# Altium schematic sheet flyback.SchDoc
size Legal; SheetNumber: 4
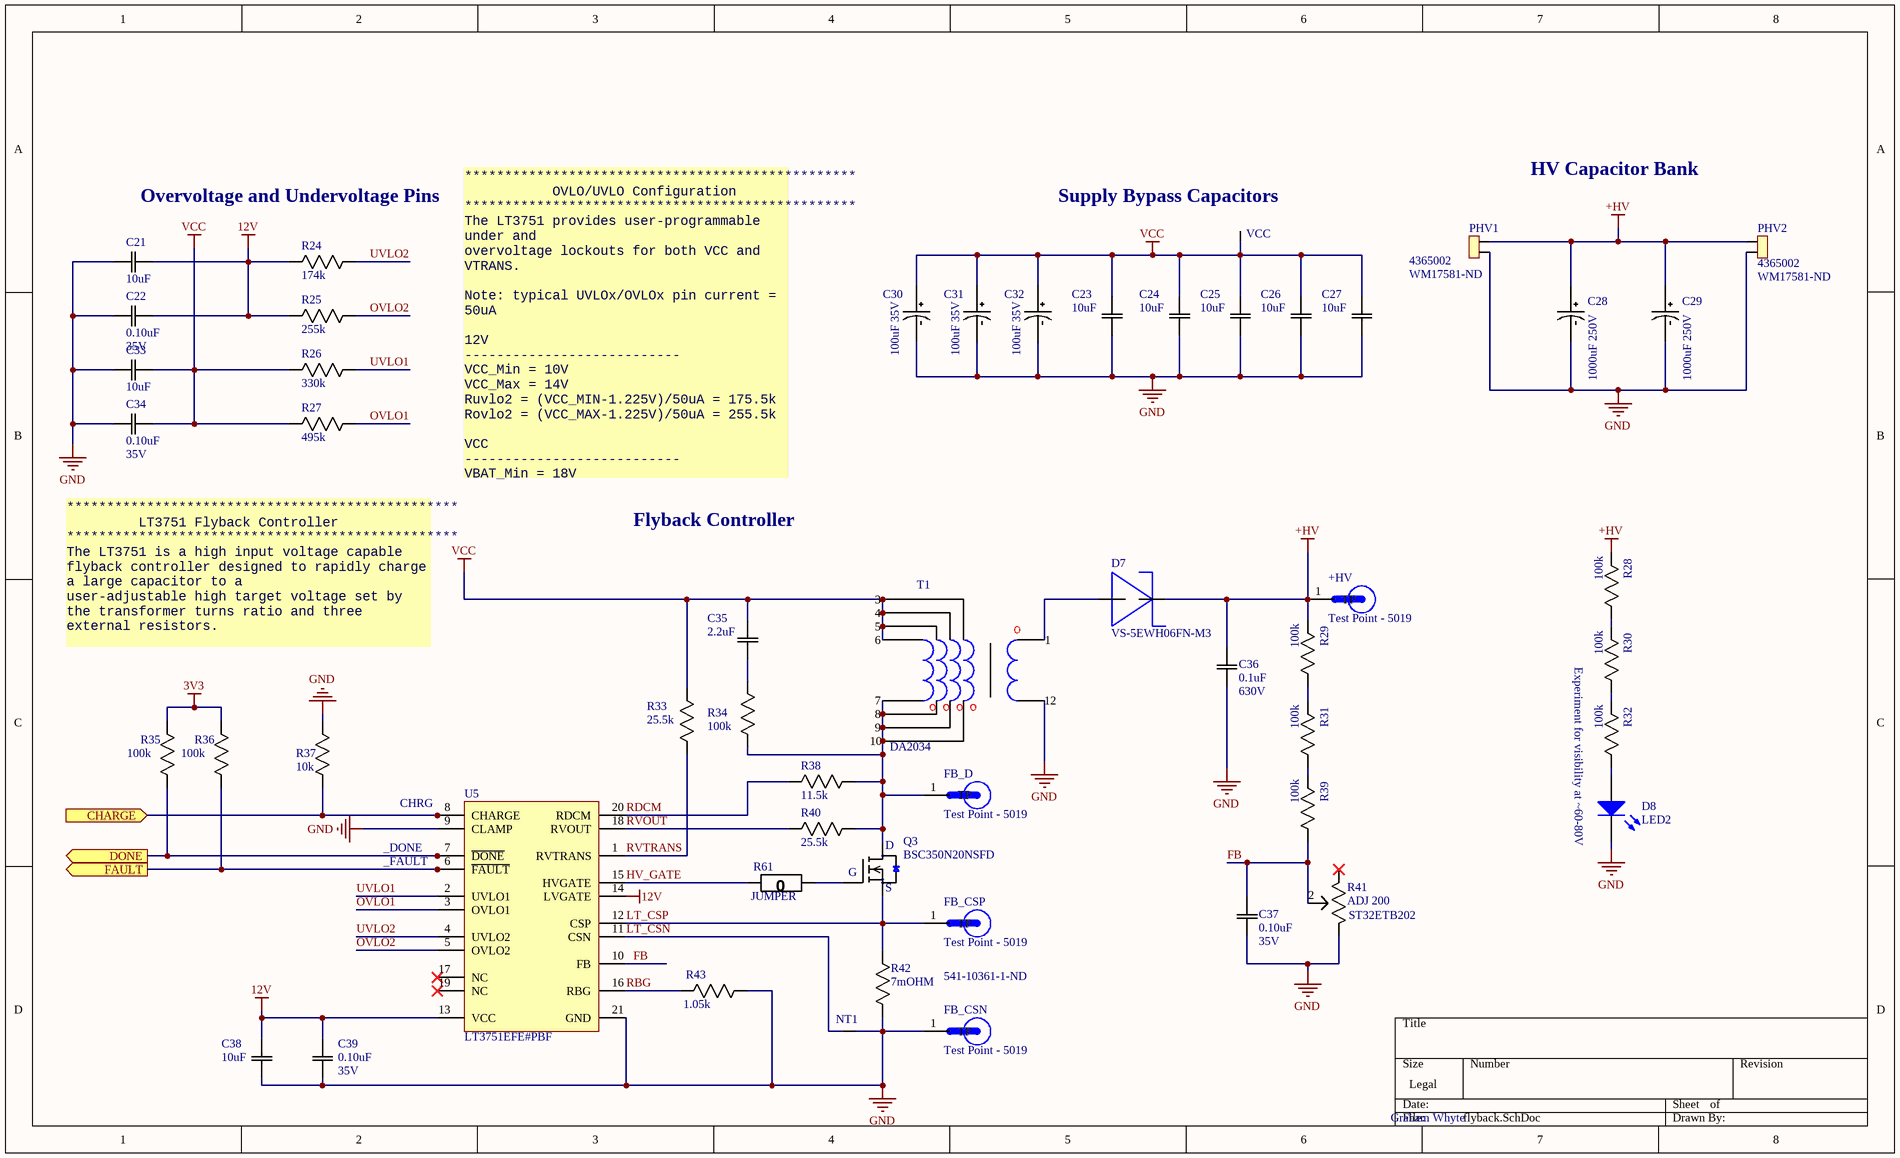
[diagram p0: flyback.SchDoc]

## Parts
+HV  Test Point - 5019  [TP380X203]
_DONE  Test Point (Via)  [TP]  (value not drawn)
_FAULT  Test Point (Via)  [TP]  (value not drawn)
C21  10uF  [0805]
C22  Rating: 35V  [0805]  (hidden comment: 0.10uF)
C23  10uF  [0805]
C24  10uF  [0805]
C25  10uF  [0805]
C26  10uF  [0805]
C27  10uF  [0805]
C28  1000uF 250V  [RADIAL, CAN - THRU 25.4mm]
C29  1000uF 250V  [RADIAL, CAN - THRU 25.4mm]
C30  100uF 35V  [CAP POL ALU 6.3x5.8]
C31  100uF 35V  [CAP POL ALU 6.3x5.8]
C32  100uF 35V  [CAP POL ALU 6.3x5.8]
C33  10uF  [0805]
C34  Rating: 35V  [0805]  (hidden comment: 0.10uF)
C35  2.2uF  [0805]
C36  Rating: 630V  [1210]  (hidden comment: 0.1uF)
C37  Rating: 35V  [0805]  (hidden comment: 0.10uF)
C38  10uF  [0805]
C39  Rating: 35V  [0805]  (hidden comment: 0.10uF)
CHRG  Test Point (Via)  [TP]  (value not drawn)
D7  VS-5EWH06FN-M3  [DPAK (TO-252)]
D8  LED2  [3.2X1.6X1.1]
FB_CSN  Test Point - 5019  [TP380X203]
FB_CSP  Test Point - 5019  [TP380X203]
FB_D  Test Point - 5019  [TP380X203]
NT1  8mil Nettie  [NT_8mil]  (value not drawn)
PHV1  4365002  Supplier Part Number 2: WM17581-ND  [43650-02]
PHV2  4365002  Supplier Part Number 2: WM17581-ND  [43650-02]
Q3  BSC350N20NSFD  [8-PowerSMD]
R24  174k  [0805]
R25  255k  [0805]
R26  330k  [0805]
R27  495k  [0805]
R28  100k  [0805]
R29  100k  [0805]
R30  100k  [0805]
R31  100k  [0805]
R32  100k  [0805]
R33  25.5k  [0805]
R34  100k  [0805]
R35  100k  [0805]
R36  100k  [0805]
R37  10k  [0805]
R38  11.5k  [0805]
R39  100k  [0805]
R40  25.5k  [0805]
R41  ADJ 200  [POT SMD]
R42  7mOHM  Supplier Part Number 1: 541-10361-1-ND  [2512]
R43  1.05k  [0805]
R61  JUMPER  [0805]
T1  DA2034  [DA2034]
U5  LT3751EFE#PBF  [LT-FE-20-EPV-CB_L]
VCC  Test Point (Via)  [TP]  (value not drawn)

## Ports
CHARGE (in), DONE (out), FAULT (out)

## Nets
3V3: R35.2(R2) R36.2(R2)
12V: C21.2(C2) C22.2(C2) C38.1(C1) C39.1(C1) R24.2(R2) R25.2(R2) U5.13(VCC) U5.14(LVGATE)
+HV: +HV.1(TP) C28.POS C29.POS C36.1(C1) D7.OUT PHV1.2 PHV2.2 R28.2(R2) R29.2(R2)
GND: C21.1(C1) C22.1(C1) C23.1(C1) C24.1(C1) C25.1(C1) C26.1(C1) C27.1(C1) C28.NEG C29.NEG C30.NEG C31.NEG C32.NEG C33.1(C1) C34.1(C1) C36.2(C2) C37.2(C2) C38.2(C2) C39.2(C2) D8.2(K) FB_CSN.1(TP) NT1.2 PHV1.1 PHV2.1 R37.1(R1) R41.3 R42.1(R1) R43.1(R1) T1.12 U5.9(CLAMP) U5.21(GND)
VCC: C23.2(C2) C24.2(C2) C25.2(C2) C26.2(C2) C27.2(C2) C30.POS C31.POS C32.POS C33.2(C2) C34.2(C2) C35.2(C2) R26.2(R2) R27.2(R2) R33.1(R1) T1.3 T1.4 T1.5 T1.6 VCC.1
CHARGE: CHRG.1 R37.2(R2) U5.8(CHARGE) ; port CHARGE
DONE: _DONE.1 R35.1(R1) U5.7(~{DONE}) ; port DONE
FAULT: _FAULT.1 R36.1(R1) U5.6(~{FAULT}) ; port FAULT
FB: C37.1(C1) R39.1(R1) R41.2 U5.10(FB)
HV_GATE: R61.2(R2) U5.15(HVGATE)
LT_CSN: NT1.1 U5.11(CSN)
LT_CSP: FB_CSP.1(TP) Q3.S R42.2(R2) U5.12(CSP)
OVLO1: R27.1(R1) U5.3(OVLO1)
OVLO2: R25.1(R1) U5.5(OVLO2)
RBG: R43.2(R2) U5.16(RBG)
RDCM: R38.2(R2) U5.20(RDCM)
RVOUT: R40.2(R2) U5.18(RVOUT)
RVTRANS: R33.2(R2) U5.1(RVTRANS)
UVLO1: R26.1(R1) U5.2(UVLO1)
UVLO2: R24.1(R1) U5.4(UVLO2)
NetC35_1: C35.1(C1) R34.1(R1)
NetD7_IN: D7.IN T1.1
NetD8_1: D8.1(A) R32.1(R1)
NetFB_D_1: FB_D.1(TP) Q3.D R34.2(R2) R38.1(R1) R40.1(R1) T1.7 T1.8 T1.9 T1.10
NetQ3_G: Q3.G R61.1(R1)
NetR28_1: R28.1(R1) R30.2(R2)
NetR29_1: R29.1(R1) R31.2(R2)
NetR30_1: R30.1(R1) R32.2(R2)
NetR31_1: R31.1(R1) R39.2(R2)

Not connected (* = marked no-connect by the designer): R41 1*; U5 17(NC)* 19(NC)*

## Notes on the sheet
- Overvoltage and Undervoltage Pins
- (near VCC) Supply Bypass Capacitors
- HV Capacitor Bank
- *************************************************
  OVLO/UVLO Configuration
  *************************************************
  The LT3751 provides user-programmable under and
  overvoltage lockouts for both VCC and VTRANS.
  Note: typical UVLOx/OVLOx pin current = 50uA
  12V
  ---------------------------
  VCC_Min = 10V
  VCC_Max = 14V
  Ruvlo2 = (VCC_MIN-1.225V)/50uA = 175.5k
  Rovlo2 = (VCC_MAX-1.225V)/50uA = 255.5k
  VCC
  ---------------------------
  VBAT_Min = 18V
  VBAT_Max = 26V
  Ruvlo1 = (VBAT_MIN-1.225V)/50uA = 335.5k
  Rovlo1 = (VBAT_MAX-1.225V)/50uA = 495.5k
- Flyback Controller
- *************************************************
  LT3751 Flyback Controller
  *************************************************
  The LT3751 is a high input voltage capable flyback controller designed to rapidly charge a large capacitor to a
  user-adjustable high target voltage set by the transformer turns ratio and three external resistors.
- Experiment for visibility at ~60-80V
- (near R41) ST32ETB202
- Graham Whyte

## Library data of the parts
+HV FB_CSN FB_CSP FB_D = Test Point - 5019: PC Test Point, Miniature Phosphor Bronze, Silver Plating Surface Mount Mounting Type; MP: 5019; MF: Keystone Electronics; Value: *; Package: 2010 Keystone; Digi-Key_Part_Number: 36-5019CT-ND; Digi-Key_Purchase_URL: https://www.digikey.com/product-detail/en/keystone-electronics/5019/36-5019CT-ND/3907344?utm_source=snapeda&utm_medium=aggregator&utm_campaign=symbol
C21 C23-C27 C33 C38 = CAP 10uF 35V: CAP CER 10UF 35V X7R 0805; Tolerance: 10%; Package: 0805; Value: 10uF; Rating: 35V; Temperature Coefficient: X7R; Operating Temperature: -55°C ~ 125°C
C22 C34 C37 C39 = CAP 0.10uF 35V: CAP CER 0.10UF 35V X7R 0603/0805; Tolerance: 10%; Package: 0603/0805; Temperature Coefficient: X7R; Operating Temperature: -55°C ~ 125°C; Value: 0.10uF
C28 C29 = CAP POL 1000uF: United Chemi-Con / ESMQ251VSN102MQ45S; Dielectric Material: Aluminium; Life (Hours): 2000Hour; Capacitance: 1mF; Tolerance: 20%; Ripple Current: 960mA; Lead Diameter: 2mm; Supplier 1: Digi-Key; Manufacturer: United Chemi-Con; Manufacturer Part Number: ESMQ251VSN102MQ45S; RoHS: Yes; Mount: Through Hole,PCB; Case/Package: Radial; Number of Pins: 2; Min Operating Temperature: -40°C; Max Operating Temperature: 85°C; Termination: Radial; Voltage: 250V; Diameter: 25.4mm; Height - Seated (Max): 45mm; Lead Pitch: 10mm; REACH SVHC: No SVHC; Lead Free: Lead Free; Supplier Part Number 1: 565-2754-ND
C30-C32 = CAP POL 100uF SMD: CAP ALUM 100UF 35V SMD; Value: 10uF; Tolerance: 20%; Rating: 50V; Temperature Coefficient: Unspecified; ComponentLink1Description: Digikey Link; ComponentLink1URL: https://www.digikey.ca/product-detail/en/panasonic-electronic-components/ECA-1HM100I/P10425CT-ND/8603345; Package: RADIAL; Operating Temperature: -40°C ~ 85°C; Dimensions: 0.197" Dia (5.00mm)
C35 = CAP 2.2uF 16V: CAP CER 2.2UF 16V X5R 0603/0805; Tolerance: 10%; Package: 0603/0805; Value: 2.2uF; Rating: 16V; Temperature Coefficient: X5R; Operating Temperature: -55°C ~ 85°C
C36 = CAP 0.1uF 630V: CAP CER 0.1uF 630V X7R 1210; Tolerance: 10%; Package: 1210; Temperature Coefficient: X7R; Operating Temperature: -55°C ~ 125°C; Value: 0.1uF
D7 = VS-5EWH06FN-M3: Diode Switching 600V 5A DPAK; pin to pad: IN>3 OUT>2; MF: Vishay Diodes; MF PN: VS-5EWH06FN-M3; Digikey: VS-5EWH06FN-M3-ND; Digikey Link: https://www.digikey.ca/en/products/detail/vishay-semiconductor-diodes-division/VS-5EWH06FN-M3/4934509
D8 = LED GREEN SMD: Typical RED, GREEN, YELLOW, AMBER GaAs LED; Voltage - Forward (Vf) (Typ): 2V; Lens Transparency: Clear; Current - Test: 20mA; Package: 1206; Color: Green
NT1 = NT_8: 8mil wide nettie
PHV1 PHV2 = CN MOLEX 4365002XX: MOLEX MICROFIT 2CKT RIGHT THRU; MF: MOLEX; MP: 4365002XX; Digikey: WM17581-ND; Digikey Link: https://www.digikey.com/en/products/detail/molex/0436500205/3310532?s=N4IgTCBcDaICwGYBsBWADGsaUgLoF8g; Package: Microfit; Price: 1.44 CAD; Value: N/A; Supplier 1: Digi-Key
Q3 = MOSFET BSC320N20NS3: MOSFET N-CH 36A 200V; MF: Infineon; Package: 8-PowerTDFN; Digikey: BSC320N20NS3GATMA1CT-ND; Digikey Link: https://www.digikey.ca/en/products/detail/infineon-technologies/BSC320N20NS3GATMA1/2337851; Supplier 1: Digi-Key; Supplier Part Number 1: BSC320N20NS3GATMA1CT-ND
R24 = RES 174k 1/8W: RES SMD 174K OHM 1% 1/8W 0805; Manufacturer: Yageo; Manufacturer Part Number: RC0805FR-07174KL; Max Power Dissipation: 125mW; Resistance: 174kR; Temperature Coefficient: 100ppm/°C; Voltage Rating: 150V; Supplier 1: Digi-Key; RoHS: Yes; Category: Chip SMD Resistors; Stock 1: 27863; Pricing 1: 1=0.10000, 10=0.04000, 100=0.01630, 1000=0.00731, 2500=0.00635 (USD); Case/Package: 0805; Case Code (Metric): 2012; Case Code (Imperial): 0805; Contact Plating: Tin,Matte; Min Operating Temperature: -55°C; Max Operating Temperature: 155°C; Package Quantity: 1; Power Rating: 125mW; Tolerance: 1%; Packaging: Tape and Reel; Features: Moisture Resistant; Composition: Thick Film; Number of Terminations: 2; Termination: SMD/SMT; Military Standard: Not; Voltage Rating (DC): 150V; Length: 2mm; Height: 0.024inch; Width: 0.049inch; Depth: 1.25mm; Radiation Hardening: No; Lead Free: Lead Free; ComponentLink1URL: https://datasheet.ciiva.com/2509/pyu-r-int-thick-7-2509472.pdf?src-supplier=Digi-Key; ComponentLink1Description: https://datasheet.ciiva.com/2509/pyu-r-int-thick-7-2509472.pdf?src-supplier=Digi-Key; ComponentLink2URL: https://datasheet.ciiva.com/2509/pyu-r-int-thick-7-2509471.pdf?src-supplier=Digi-Key; ComponentLink2Description: https://datasheet.ciiva.com/2509/pyu-r-int-thick-7-2509471.pdf?src-supplier=Digi-Key; ComponentLink3URL: https://datasheet.ciiva.com/2509/pyu-r-int-thick-7-2509473.pdf?src-supplier=Digi-Key; ComponentLink3Description: https://datasheet.ciiva.com/2509/pyu-r-int-thick-7-2509473.pdf?src-supplier=Digi-Key; Supplier Part Number 1: 311-174KCRCT-ND
R25 = RES 255k 0805: 0805 Resistor, 6A, 0.125W, 25ppm, 0.1%, 255K; Manufacturer: Panasonic; Manufacturer Part Number: ERA-6AEB2553V; Max Power Dissipation: 125mW; Resistance: 255kR; Temperature Coefficient: 25ppm/°C; Voltage Rating (DC): 100V; Voltage Rating: 200V; Supplier 1: Digi-Key; RoHS: Yes; Category: Chip SMD Resistors; Stock 1: 7869; Pricing 1: 1=0.36000, 10=0.30200, 100=0.11820, 1000=0.04948, 2500=0.04536 (USD); Mount: Surface Mount; Case/Package: 0805; Number of Pins: 2; Weight: 0.000194oz; Case Code (Imperial): 0805; Case Code (Metric): 2012; Contact Plating: Tin; Min Operating Temperature: -55°C; Max Operating Temperature: 155°C; Features: Automotive AEC-Q200; Tolerance: 0.1%; Number of Terminations: 2; Packaging: Tape and Reel; Composition: Metal Film,Thin Film; Power Rating: 125mW; Termination: SMD/SMT; Military Standard: Not; Package Quantity: 1; Length: 2mm; Height: 0.5mm; Width: 1.25mm; Depth: 1.25mm; Radiation Hardening: No; Lead Free: Lead Free; REACH SVHC: No SVHC; ComponentLink1URL: https://datasheet.ciiva.com/11810/0900766b80eb1d8c-11810615.pdf?src-supplier=RSComponents; ComponentLink1Description: https://datasheet.ciiva.com/11810/0900766b80eb1d8c-11810615.pdf?src-supplier=RSComponents; ComponentLink2URL: https://datasheet.ciiva.com/41450/001181380-da-01-en-widerstand-era-0805-255k-0-1-5000st-41450539.pdf?src-supplier=Conrad; ComponentLink2Description: https://datasheet.ciiva.com/41450/001181380-da-01-en-widerstand-era-0805-255k-0-1-5000st-41450539.pdf?src-supplier=Conrad; ComponentLink3URL: https://datasheet.ciiva.com/5981/485442-5981317.pdf?src-supplier=Farnell; ComponentLink3Description: https://datasheet.ciiva.com/5981/485442-5981317.pdf?src-supplier=Farnell; ComponentLink4URL: https://datasheet.ciiva.com/5981/485442-5981318.pdf?src-supplier=Farnell; ComponentLink4Description: https://datasheet.ciiva.com/5981/485442-5981318.pdf?src-supplier=Farnell; ComponentLink5URL: https://datasheet.ciiva.com/5981/485442-5981319.pdf?src-supplier=Farnell; ComponentLink5Description: https://datasheet.ciiva.com/5981/485442-5981319.pdf?src-supplier=Farnell; ComponentLink6URL: https://datasheet.ciiva.com/5981/485442-5981320.pdf?src-supplier=Farnell; ComponentLink6Description: https://datasheet.ciiva.com/5981/485442-5981320.pdf?src-supplier=Farnell; ComponentLink7URL: https://datasheet.ciiva.com/17206/aoa0000ce26-17206655.pdf?src-supplier=Avnet+Europe; ComponentLink7Description: https://datasheet.ciiva.com/17206/aoa0000ce26-17206655.pdf?src-supplier=Avnet+Europe; Supplier Part Number 1: P255KDACT-ND
R26 = RES 330k 1/8W - 1%: RES SMD 274K OHM 1% 1/8W 0805
R27 = RES 495k 1/8W: RES SMD 499K OHM 1% 1/8W 0805; Manufacturer: Yageo; Manufacturer Part Number: RC0805FR-07499KL; Temperature Coefficient: 100ppm/°C; Voltage Rating (DC): 150V; Resistance: 499kR; Power Rating: 125mW; Supplier 1: Digi-Key; RoHS: Yes; Category: Chip SMD Resistors; Stock 1: 2275; Pricing 1: 1=0.10000, 10=0.04000, 100=0.01630, 1000=0.00731, 2500=0.00635 (USD); Case/Package: 0805; Case Code (Metric): 2012; Case Code (Imperial): 0805; Contact Plating: Tin,Lead,Matte; Min Operating Temperature: -55°C; Max Operating Temperature: 155°C; Termination: SMD/SMT; Composition: Thick Film; Military Standard: Not; Tolerance: 1%; Voltage Rating: 150V; Packaging: Tape and Reel; Length: 2mm; Depth: 1.25mm; Radiation Hardening: No; Lead Free: Lead Free; ComponentLink1URL: https://datasheet.ciiva.com/15189/getdatasheetpartid-326570-15189975.pdf?src-supplier=Verical; ComponentLink1Description: https://datasheet.ciiva.com/15189/getdatasheetpartid-326570-15189975.pdf?src-supplier=Verical; Supplier Part Number 1: 311-499KCRCT-ND
R28 R30 R32 = RES 100k 1/8W - 5%: RES SMD 100K OHM 5% 1/8W 0805; Power (Watts): 0.125W; Package: 0805; Value: 100k; Tolerance: 5%
R29 R31 R34-R36 R39 = RES 100k 1/8W - 1%: RES SMD 100K OHM 1% 1/8W 0805; Power (Watts): 0.125W; Package: 0805; Value: 100k; Tolerance: 1%
R33 R40 = RES 25.5k 1/8W: RES SMD 25.5K OHM 0.1% 1/8W 0805; Manufacturer: Panasonic; Manufacturer Part Number: ERA-6AEB2552V; Temperature Coefficient: 25ppm/°C; Max Power Dissipation: 125mW; Resistance: 25.5kR; Voltage Rating: 100V; Supplier 1: Digi-Key; RoHS: Yes; Category: Chip SMD Resistors; Stock 1: 5872; Pricing 1: 1=0.36000, 10=0.30200, 100=0.11820, 1000=0.04948, 2500=0.04536 (USD); Mount: Surface Mount; Case/Package: 0805; Number of Pins: 2; Case Code (Imperial): 0805; Case Code (Metric): 2012; Contact Plating: Tin; Min Operating Temperature: -55°C; Max Operating Temperature: 155°C; Number of Terminations: 2; Features: Automotive AEC-Q200; Tolerance: 0.1%; Composition: Metal Film,Thin Film; Packaging: Tape and Reel; Military Standard: Not; Termination: Solder; Power Rating: 125mW; Package Quantity: 1; Voltage Rating (DC): 100V; Length: 2mm; Height: 0.5mm; Width: 1.25mm; Depth: 1.25mm; Radiation Hardening: No; Lead Free: Lead Free; ComponentLink1URL: https://datasheet.ciiva.com/11810/0900766b80eb1d8c-11810651.pdf?src-supplier=RSComponents; ComponentLink1Description: https://datasheet.ciiva.com/11810/0900766b80eb1d8c-11810651.pdf?src-supplier=RSComponents; ComponentLink2URL: https://datasheet.ciiva.com/26335/459526-da-01-en-widerstand-0805-era-26335831.pdf?src-supplier=Conrad; ComponentLink2Description: https://datasheet.ciiva.com/26335/459526-da-01-en-widerstand-0805-era-26335831.pdf?src-supplier=Conrad; ComponentLink3URL: https://datasheet.ciiva.com/7870/485442-7870651.pdf?src-supplier=Element14; ComponentLink3Description: https://datasheet.ciiva.com/7870/485442-7870651.pdf?src-supplier=Element14; ComponentLink4URL: https://datasheet.ciiva.com/5987/485442-5987308.pdf?src-supplier=Farnell; ComponentLink4Description: https://datasheet.ciiva.com/5987/485442-5987308.pdf?src-supplier=Farnell; ComponentLink5URL: https://datasheet.ciiva.com/7870/485442-7870652.pdf?src-supplier=Element14; ComponentLink5Description: https://datasheet.ciiva.com/7870/485442-7870652.pdf?src-supplier=Element14; ComponentLink6URL: https://datasheet.ciiva.com/30151/54aoa0000ce26-30151583.pdf?src-supplier=Onlinecomponents.com; ComponentLink6Description: https://datasheet.ciiva.com/30151/54aoa0000ce26-30151583.pdf?src-supplier=Onlinecomponents.com; ComponentLink7URL: https://datasheet.ciiva.com/9191/aoa0000ce26-9191422.pdf?src-supplier=Avnet; ComponentLink7Description: https://datasheet.ciiva.com/9191/aoa0000ce26-9191422.pdf?src-supplier=Avnet; Supplier Part Number 1: P25.5KDACT-ND
R37 = RES 10k 1/8W - 1%: RES SMD 10K OHM 1% 1/8W 0805; Power (Watts): 0.125W; Package: 0805; Value: 10k; Tolerance: 1%
R38 = RES 11.5k 1/8W: RES SMD 11.5K OHM 0.1% 1/8W 0805 Thin Film; Manufacturer: Panasonic; Manufacturer Part Number: ERA-6AEB1152V; Power Rating: 125mW; Resistance: 11.5kR; Voltage Rating: 100V; Temperature Coefficient: 25ppm/°C; Supplier 1: Digi-Key; RoHS: Yes; Category: Chip SMD Resistors; Stock 1: 10661; Pricing 1: 1=0.34000, 10=0.28800, 100=0.11260, 1000=0.04712, 2500=0.04320 (USD); Mount: Surface Mount; Case/Package: 0805; Number of Pins: 2; Case Code (Metric): 2012; Case Code (Imperial): 0805; Contact Plating: Tin; Min Operating Temperature: -55°C; Max Operating Temperature: 155°C; Tolerance: 0.1%; Packaging: Tape and Reel; Max Power Dissipation: 125mW; Composition: Thin Film,Metal Film; Number of Terminations: 2; Voltage Rating (DC): 100V; Termination: Solder; Military Standard: Not; Package Quantity: 1; Features: Automotive AEC-Q200; Length: 2mm; Height: 0.5mm; Width: 1.25mm; Depth: 1.25mm; Radiation Hardening: No; Lead Free: Lead Free; ComponentLink1URL: https://datasheet.ciiva.com/11810/0900766b80eb1d8c-11810868.pdf?src-supplier=RSComponents; ComponentLink1Description: https://datasheet.ciiva.com/11810/0900766b80eb1d8c-11810868.pdf?src-supplier=RSComponents; ComponentLink2URL: https://datasheet.ciiva.com/41450/001181306-da-01-en-widerstand-era-0805-11k5-0-1-5000st-41450464.pdf?src-supplier=Conrad; ComponentLink2Description: https://datasheet.ciiva.com/41450/001181306-da-01-en-widerstand-era-0805-11k5-0-1-5000st-41450464.pdf?src-supplier=Conrad; ComponentLink3URL: https://datasheet.ciiva.com/5987/485442-5987301.pdf?src-supplier=Farnell; ComponentLink3Description: https://datasheet.ciiva.com/5987/485442-5987301.pdf?src-supplier=Farnell; ComponentLink4URL: https://datasheet.ciiva.com/7829/485442-7829142.pdf?src-supplier=Element14; ComponentLink4Description: https://datasheet.ciiva.com/7829/485442-7829142.pdf?src-supplier=Element14; ComponentLink5URL: https://datasheet.ciiva.com/17211/aoa0000ce26-17211855.pdf?src-supplier=Avnet+Europe; ComponentLink5Description: https://datasheet.ciiva.com/17211/aoa0000ce26-17211855.pdf?src-supplier=Avnet+Europe; ComponentLink6URL: https://datasheet.ciiva.com/7829/485442-7829143.pdf?src-supplier=Element14; ComponentLink6Description: https://datasheet.ciiva.com/7829/485442-7829143.pdf?src-supplier=Element14; ComponentLink7URL: https://datasheet.ciiva.com/9193/aoa0000ce26-9193735.pdf?src-supplier=Avnet; ComponentLink7Description: https://datasheet.ciiva.com/9193/aoa0000ce26-9193735.pdf?src-supplier=Avnet; ComponentLink8URL: https://datasheet.ciiva.com/24024/aoa0000ce26-197354-24024328.pdf?src-supplier=Mouser; ComponentLink8Description: https://datasheet.ciiva.com/24024/aoa0000ce26-197354-24024328.pdf?src-supplier=Mouser; Supplier Part Number 1: P11.5KDACT-ND
R41 = RES POT 200: SMD Potentiometer 200Ohm Range
R42 = RES 7m 3W: RES SMD 7m OHM 1% 3W 2512; MFG: VISHAY; Package: 1206; Resistance: 7mOHM; Power (Watts): 3W; Tolerance: 1%; ComponentLink1Description: Digikey Link; ComponentLink1URL: https://www.digikey.com/en/products/detail/vishay-dale/WFMB2512R0500FEA/9972278; Digikey: 541-10282-1-ND; Supplier 1: Digi-Key
R43 = RES 1.05k 1/8W: RES SMD 1.05K OHM 0.1% 1/8W 0805; Wattage: 0.125W; Package: 0805; Value: 1.05k; Tolerance: 0.1%; Supplier 1: Digi-Key; Supplier Part Number 1: P1.05KDACT-ND
R61 = RES 0 JUMPER: RES SMD 0 OHM JUMPER GENERIC 0805; Value: 0; Package: 0805
T1 = DA2034: Audio Transformers / Signal Transformers DA2032 Cap Chrgr For Linear LT3750/51; Supplier 1: Mouser; Supplier Part Number 1: 994-DA2034-ALB
U5 = LT3751EFE#PBF: Controller to 20-Pin TSSOP EP; Manufacturer: Analog Devices / Linear Technology; Output Voltage: 500V; Output Current: 150mA; Max Input Voltage: 24V; Min Supply Voltage: 4.75V; Number of Outputs: 1; Operating Supply Current: 5.5mA; Supplier 1: Digi-Key; Manufacturer Part Number: LT3751EFE#PBF; RoHS: Yes; Category: Voltage Regulators - Switching; Stock 1: 1231; Pricing 1: 1=9.26000, 25=6.14640, 100=5.08200, 250=4.82792, 500=4.71900 (USD); Case/Package: TSSOP; Number of Pins: 20; Min Operating Temperature: -40°C; Max Operating Temperature: 125°C; Package Quantity: 74; Packaging: Rail/Tube; Termination: SMD/SMT; Max Supply Voltage: 24V; Radiation Hardening: No; REACH SVHC: No SVHC; ComponentLink1URL: https://datasheet.ciiva.com/15104/getdatasheetpartid-472813-15104438.pdf?src-supplier=Verical; ComponentLink1Description: https://datasheet.ciiva.com/15104/getdatasheetpartid-472813-15104438.pdf?src-supplier=Verical; ComponentLink2URL: https://datasheet.ciiva.com/31429/1692507-31429494.pdf?src-supplier=Farnell; ComponentLink2Description: https://datasheet.ciiva.com/31429/1692507-31429494.pdf?src-supplier=Farnell; ComponentLink3URL: https://datasheet.ciiva.com/1964/27024-1964843.pdf?src-supplier=Digi-Key; ComponentLink3Description: https://datasheet.ciiva.com/1964/27024-1964843.pdf?src-supplier=Digi-Key